# Altium project BC-MPR.PrjPcb (part 2 of 2)

## Sheet MCU Power Clock Debug.SchDoc
size A4; Engineer: Farris Matar; Organization: TESLA Motors, INC; Address1: 3500 Deer Creek Road; Address2: Palo Alto, CA; Address4: U.S.A.; SheetNumber: 10; SheetTotal: 14
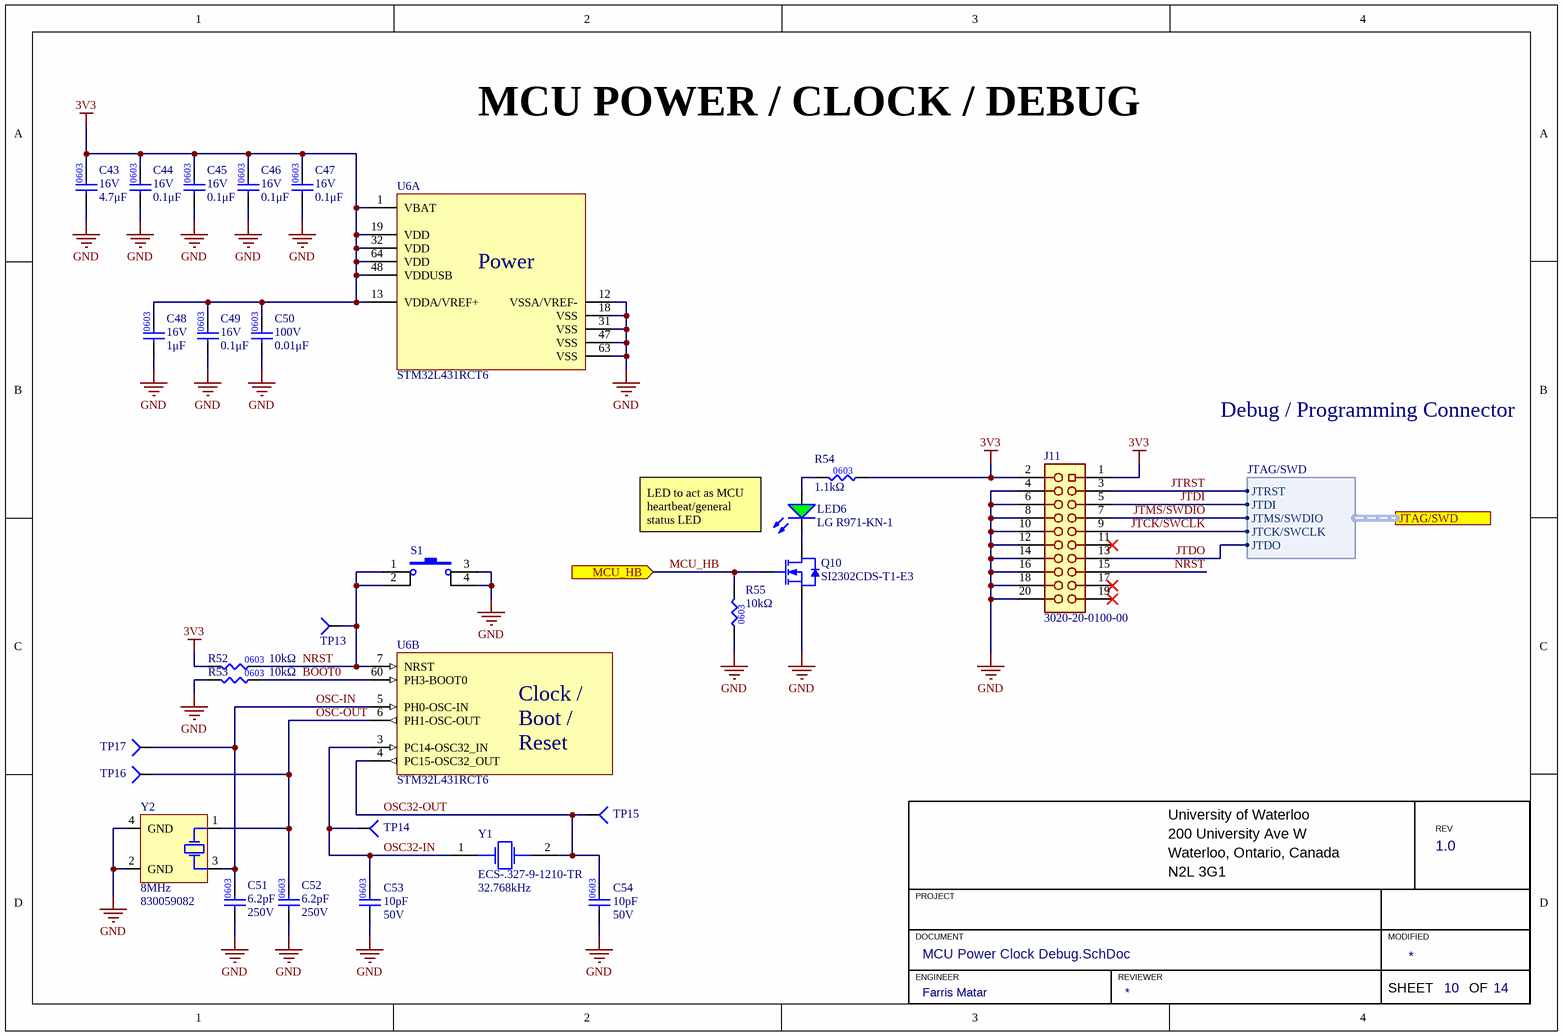
[diagram p8: MCU Power Clock Debug.SchDoc]

### Parts
C43  value 4.7μF  Voltage Rating: 16V  [CAP0603]  (hidden comment: CAP_4.7uF_16V_0603)
C44  value 0.1μF  Voltage Rating: 16V  [CAP0603]  (hidden comment: CAP_0.1uF_16V_0603)
C45  value 0.1μF  Voltage Rating: 16V  [CAP0603]  (hidden comment: CAP_0.1uF_16V_0603)
C46  value 0.1μF  Voltage Rating: 16V  [CAP0603]  (hidden comment: CAP_0.1uF_16V_0603)
C47  value 0.1μF  Voltage Rating: 16V  [CAP0603]  (hidden comment: CAP_0.1uF_16V_0603)
C48  value 1μF  Voltage Rating: 16V  [CAP0603]  (hidden comment: CAP_1uF_16V_0603)
C49  value 0.1μF  Voltage Rating: 16V  [CAP0603]  (hidden comment: CAP_0.1uF_16V_0603)
C50  value 0.01μF  Voltage Rating: 100V  [CAP0603]  (hidden comment: CAP_0.01uF_100V_0603)
C51  value 6.2pF  Voltage Rating: 250V  [CAP0603]  (hidden comment: CAP_6.2pF_250V_0603)
C52  value 6.2pF  Voltage Rating: 250V  [CAP0603]  (hidden comment: CAP_6.2pF_250V_0603)
C53  value 10pF  Voltage Rating: 50V  [CAP0603]  (hidden comment: CAP_10pF_50V_0603)
C54  value 10pF  Voltage Rating: 50V  [CAP0603]  (hidden comment: CAP_10pF_50V_0603)
J11  3020-20-0100-00  [CNC_3020-20-0100-00]
LED6  Manufacturer Part Number 1: LG R971-KN-1  [LED_0805_GREEN]  (hidden comment: LED_GREEN)
Q10  Manufacturer Part Number 1: SI2302CDS-T1-E3  [SOT23-3]  (hidden comment: NMOS_20V_6A)
R52  value 10kΩ  [RES0603]  (hidden comment: RES_10kΩ_0603_1%)
R53  value 10kΩ  [RES0603]  (hidden comment: RES_10kΩ_0603_1%)
R54  value 1.1kΩ  [RES0603]  (hidden comment: RES_1.1kΩ_0603_1%)
R55  value 10kΩ  [RES0603]  (hidden comment: RES_10kΩ_0603_1%)
S1  SW_SPST_NO_4.5x4.5  [SPST_PUSHBUTTON_TL3305AF260QG]  (value not drawn)
TP13  TESTPOINT_1MM_CIRCLE  [TESTPOINT_CIRCLE_1MM]  (value not drawn)  (no BOM)
TP14  TESTPOINT_1MM_CIRCLE  [TESTPOINT_CIRCLE_1MM]  (value not drawn)  (no BOM)
TP15  TESTPOINT_1MM_CIRCLE  [TESTPOINT_CIRCLE_1MM]  (value not drawn)  (no BOM)
TP16  TESTPOINT_1MM_CIRCLE  [TESTPOINT_CIRCLE_1MM]  (value not drawn)  (no BOM)
TP17  TESTPOINT_1MM_CIRCLE  [TESTPOINT_CIRCLE_1MM]  (value not drawn)  (no BOM)
U6  STM32L431RCT6  [STM_LQFP64]  (parts A,B of 5)
Y1  Frequency: 32.768kHz  Manufacturer Part Number 1: ECS-.327-9-1210-TR  [OSC_ECS-327TR-2]  (hidden comment: CRYSTAL_32.768KHZ)
Y2  Frequency: 8MHz  Manufacturer Part Number 1: 830059082  [XTAL_WURTH_830059082]  (hidden comment: CRYSTAL_25MHZ)

### Ports
JTAG/SWD (harness JTAG/SWD), MCU_HB (in)

### Harnesses
JTAG/SWD: JTRST, JTDI, JTMS/SWDIO, JTCK/SWCLK, JTDO

### Nets
3V3: C43.2 C44.2 C45.2 C46.2 C47.2 C48.2 C49.2 C50.2 J11.1 J11.2 R52.1 R54.1 U6.1(VBAT) U6.13(VDDA/VREF+) U6.19(VDD) U6.32(VDD) U6.48(VDDUSB) U6.64(VDD)
GND: C43.1 C44.1 C45.1 C46.1 C47.1 C48.1 C49.1 C50.1 C51.1 C52.1 C53.1 C54.1 J11.4 J11.6 J11.8 J11.10 J11.12 J11.14 J11.16 J11.18 J11.20 Q10.2(SOURCE) R53.1 R55.1 S1.3 S1.4 U6.12(VSSA/VREF-) U6.18(VSS) U6.31(VSS) U6.47(VSS) U6.63(VSS) Y2.2(GND) Y2.4(GND)
BOOT0: R53.2 U6.60(PH3-BOOT0)
JTCK/SWCLK: J11.9 ; port JTAG/SWD.JTCK/SWCLK
JTDI: J11.5 ; port JTAG/SWD.JTDI
JTDO: J11.13 ; port JTAG/SWD.JTDO
JTMS/SWDIO: J11.7 ; port JTAG/SWD.JTMS/SWDIO
JTRST: J11.3 ; port JTAG/SWD.JTRST
MCU_HB: Q10.1(GATE) R55.2 ; port MCU_HB
NRST: J11.15 R52.2 S1.1 S1.2 TP13.1(=value) U6.7(NRST)
OSC32-IN: C53.2 TP14.1(=value) U6.3(PC14-OSC32_IN) Y1.1
OSC32-OUT: C54.2 TP15.1(=value) U6.4(PC15-OSC32_OUT) Y1.2
OSC-IN: C51.2 TP17.1(=value) U6.5(PH0-OSC-IN) Y2.3(HOT)
OSC-OUT: C52.2 TP16.1(=value) U6.6(PH1-OSC-OUT) Y2.1(HOT)
NetLED6_1: LED6.1(A) R54.2
NetLED6_2: LED6.2(K) Q10.3(DRAIN)

Not connected (* = marked no-connect by the designer): J11 11* 17* 19*

### Notes on the sheet
- MCU POWER / CLOCK / DEBUG
- Debug / Programming Connector
- LED to act as MCU heartbeat/general status LED
- University of Waterloo
- 200 University Ave W
- REV
- PROJECT
- Waterloo, Ontario, Canada
- N2L 3G1
- DOCUMENT
- ENGINEER
- REVIEWER
- MODIFIED
- SHEET
- OF
- (in symbol CAP_0.01uF_100V_0603) 0603
- (in symbol STM32L431RCT6, part A) Power
- (in symbol STM32L431RCT6, part B) Clock / / Boot / / Reset

### Library data of the parts
C43 = CAP_4.7uF_16V_0603: CAP CER 4.7UF 16V X6S 0603; Manufacturer Part Number 1: GRM188C81C475KE11D; Manufacturer 1: Murata Electronics; Supplier Part Number 1: 490-13362-1-ND; Supplier 1: Digi-Key; Mounting Type: SMD; Package: 0603; Dielectric: X6S
C44-C47 C49 = CAP_0.1uF_16V_0603: CAP CER 0.1UF 16V X7R 0603; Manufacturer Part Number 1: CC0603KRX7R7BB104; Manufacturer 1: Yageo; Package: 0603; Supplier Part Number 1: 311-1088-1-ND; Supplier 1: Digi-Key; Dielectric: X7R
C48 = CAP_1uF_16V_0603: CAP CER 1UF 16V X7R 0603; Manufacturer 1: Yageo; Manufacturer Part Number 1: CC0603KPX7R7BB105; Supplier Part Number 1: 13-CC0603KPX7R7BB105CT-ND; Supplier 1: Digi-Key; Mounting Type: SMD; Package: 0603; Dielectric: X7R
C50 = CAP_0.01uF_100V_0603: CAP CER 0.01uF 100V X7R 0603; Manufacturer Part Number 1: GCM188R72A103KA37J; Manufacturer 1: Murata Electronics; Supplier Part Number 1: 490-8028-1-ND; Supplier 1: Digi-Key; Dielectric: X7R
C51 C52 = CAP_6.2pF_250V_0603: HVCAP0603 COG 6.2PF .25PF 250V; Manufacturer Part Number 1: CHV0603N2506R2CCT; Manufacturer 1: Cal-Chip Electronics, Inc.; Dielectric: C0G, NP0; Supplier Part Number 1: 4713-CHV0603N2506R2CCT-ND; Supplier 1: Digi-Key; Mounting Type: SMD; Package: 0603
C53 C54 = CAP_10pF_50V_0603: CAP CER 10PF 50V X7R 0603; Manufacturer 1: KEMET; Manufacturer Part Number 1: C0603C100J5RAC7867; Package: 0603; Supplier 1: Digi-Key; Supplier Part Number 1: 399-C0603C100J5RAC7867CT-ND
J11 = CON_10x2_HEADER: CONN HEADER VERT 20POS 2.54MM; Manufacturer 1: CNC Tech; Manufacturer Part Number 1: 3020-20-0100-00; Supplier 1: Digi-Key; Supplier Part Number 1: 1175-1612-ND
LED6 = LED_GREEN: LED GREEN DIFFUSED 0805 SMD; Manufacturer 1: OSRAM; Forward Voltage Drop: 2.2V; Package/Footprint: 0805; Supplier Part Number 1: 475-1410-1-ND; Supplier 1: Digi-Key; Mounting Type: SMD
Q10 = NMOS_20V_2.6A: MOSFET N-CH 20V 2.6A SOT23-3; Manufacturer 1: Vishay Siliconix; Package/Footprint: SOT-23-3; Supplier 1: Digi-Key; Supplier Part Number 1: SI2302CDS-T1-E3CT-ND
R52 R53 R55 = RES_10kΩ_0603_1%: as R5 on sheet Ideal Diode; Supplier Part Number 1: RNCP0603FTD10K0CT-ND; Supplier 1: Digi-Key; Mounting Type: SMD; Package: 0603
R54 = RES_1.1kΩ_0603_1%: RES 1.1K OHM 1% 1/10W 0603; Manufacturer 1: Yageo; Manufacturer Part Number 1: RC0603FR-071K1L; Supplier Part Number 1: 311-1.10KHRCT-ND; Supplier 1: Digi-Key; Mounting Type: SMD; Package: 0603
S1 = SW_SPST_NO_4.5x4.5: SWITCH TACTILE SPST-NO 50MA 12V; Manufacturer Part Number 1: TL3305AF260QG; Manufacturer 1: E-Switch; Mounting Type: SMD; Supplier 1: Digi-Key; Supplier Part Number 1: EG5353CT-ND
TP13-TP17 = TESTPOINT_1MM_CIRCLE: TESTPOINT 1MM CIRCLE
U6 = STM32L431RCT6: IC MCU 32BIT 256KB FLASH 64LQFP; Manufacturer 1: STMicroelectronics; Package/Footprint: 64-LQFP; Manufacturer Part Number 1: STM32L431RCT6; Supplier 1: Digi-Key; Supplier Part Number 1: 497-17960-ND
Y1 = CRYSTAL_32.768KHZ: CRYSTAL 32.7680KHZ 9PF SMD; Manufacturer 1: ECS Inc.; Supplier 1: Digi-Key; Supplier Part Number 1: XC2283CT-ND
Y2 = CRYSTAL_8MHZ_8PF: WE-XTAL QUARTZ CRYSTAL 8.0 MHZ;; Manufacturer 1: Kyocera AVX; Package/Footprint: SMD; Load Capacitance: 10pF; Mounting Type: SMD; Supplier 1: Digikey; Supplier Part Number 1: 1923-830059082CT-ND

## Sheet Control Interface Board.SchDoc
size A4; Engineer: Farris Matar; Organization: TESLA Motors, INC; Address1: 3500 Deer Creek Road; Address2: Palo Alto, CA; Address4: U.S.A.; SheetNumber: 11; SheetTotal: 13
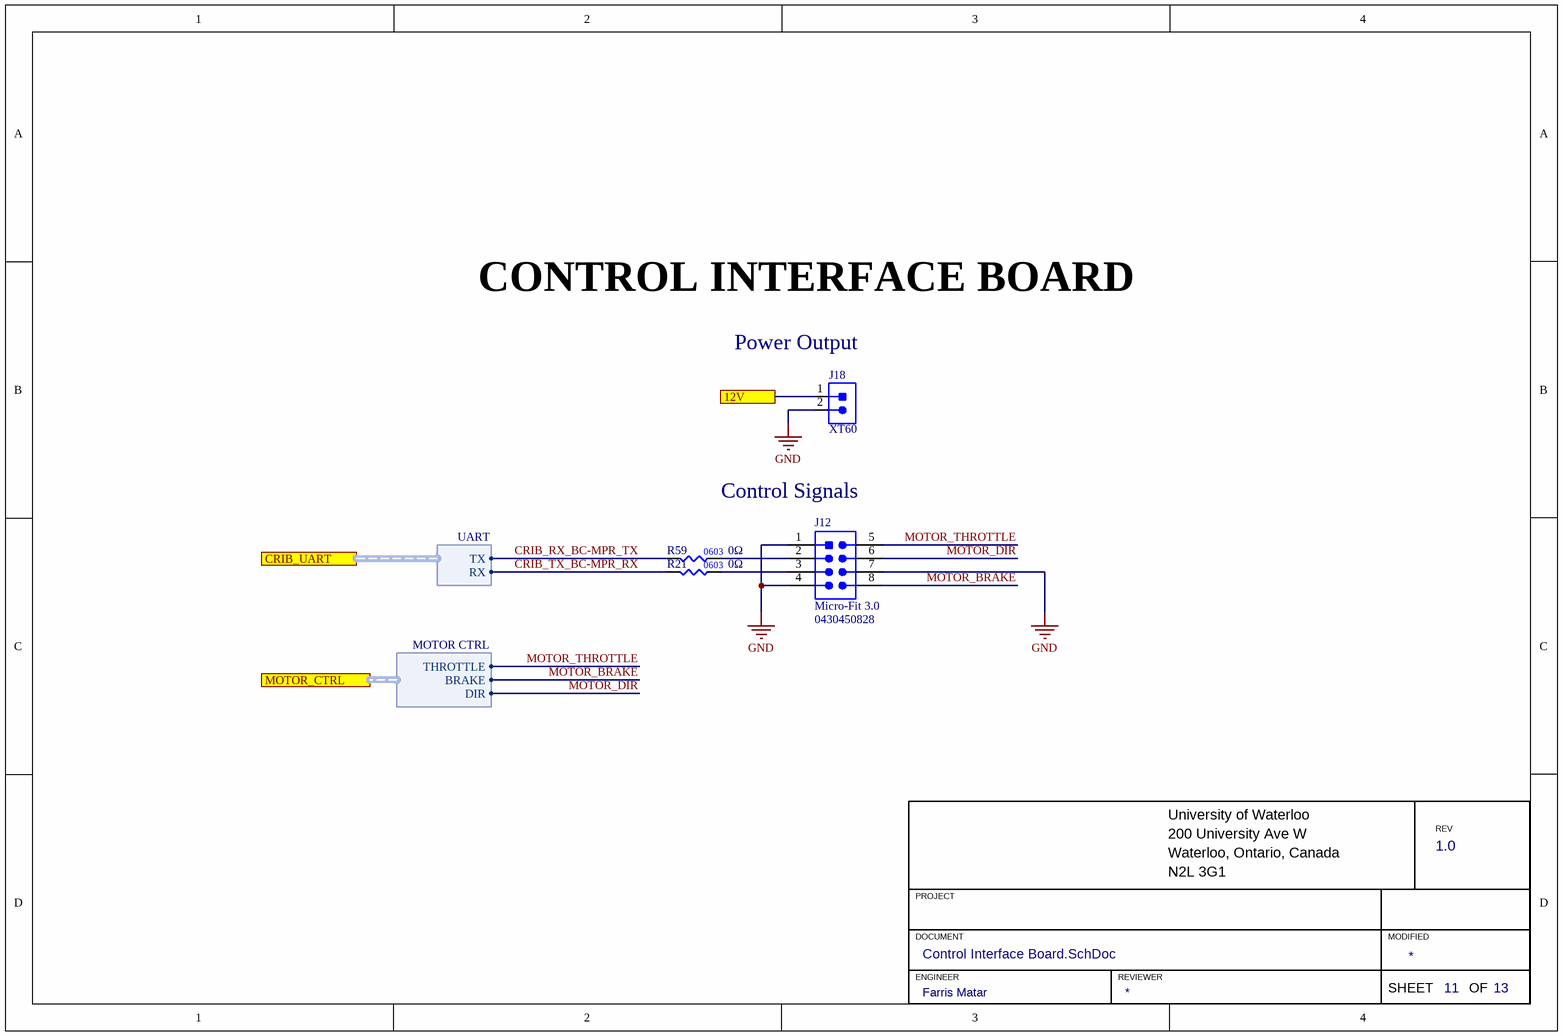
[diagram p9: Control Interface Board.SchDoc]

### Parts
J12  Family: Micro-Fit 3.0  [MOLEX-0430450828]  (hidden comment: 0430450828)
J18  CON_2POS_XT60  [XT60]  (value not drawn)
R21  value 0Ω  [RES0603]  (hidden comment: RES_0Ω_0603)
R59  value 0Ω  [RES0603]  (hidden comment: RES_0Ω_0603)

### Ports
12V, CRIB_UART (harness UART), MOTOR_CTRL (harness MOTOR CTRL)

### Harnesses
UART: TX, RX
MOTOR CTRL: THROTTLE, BRAKE, DIR

### Nets
12V: J18.1 ; port 12V
GND: J12.1 J12.4 J12.7 J18.2
CRIB_RX_BC-MPR_TX: R59.1 ; port CRIB_UART.TX
CRIB_TX_BC-MPR_RX: R21.1 ; port CRIB_UART.RX
MOTOR_BRAKE: J12.8 ; port MOTOR_CTRL.BRAKE
MOTOR_DIR: J12.6 ; port MOTOR_CTRL.DIR  [project net MOTOR_CTRL.DIR]
MOTOR_THROTTLE: J12.5 ; port MOTOR_CTRL.THROTTLE  [project net MOTOR_CTRL.THROTTLE]
NetJ12_2: J12.2 R59.2
NetJ12_3: J12.3 R21.2

### Notes on the sheet
- CONTROL INTERFACE BOARD
- (near J18) Power Output
- Control Signals
- University of Waterloo
- 200 University Ave W
- REV
- PROJECT
- Waterloo, Ontario, Canada
- N2L 3G1
- DOCUMENT
- ENGINEER
- REVIEWER
- MODIFIED
- SHEET
- OF

### Library data of the parts
J12 = CON_MOLEX-HDR_4x2_TH: CONN HEADER VERT 8POS 3MM; Manufacturer 1: Molex; Voltage Rating: 250VAC; Current Rating: 5A; Pitch: 3mm; Supplier 1: Digi-Key; Supplier Part Number 1: WM10693-ND; Manufacturer Part Number 1: 0430450828
J18 = CON_2POS_XT60: XT60 CONNECTORS MALE/FEMALE PAIR; Manufacturer 1: SparkFun Electronics; Manufacturer Part Number 1: PRT-10474; Mounting Type: TH; Package/Footprint: XT60; Supplier 1: Digi-Key; Supplier Part Number 1: 1568-1816-ND
R21 R59 = RES_0Ω_0603: RES 0 OHM JUMPER 1/10W 0603; Manufacturer 1: Yageo; Manufacturer Part Number 1: RC0603JR-070RL; Supplier Part Number 1: 311-0.0GRCT-ND; Supplier 1: Digi-Key; Mounting Type: SMD; Package: 0603

## Sheet External Supply Interface.SchDoc
size A4; Engineer: Farris Matar; Organization: TESLA Motors, INC; Address1: 3500 Deer Creek Road; Address2: Palo Alto, CA; Address4: U.S.A.; SheetNumber: 12; SheetTotal: 13
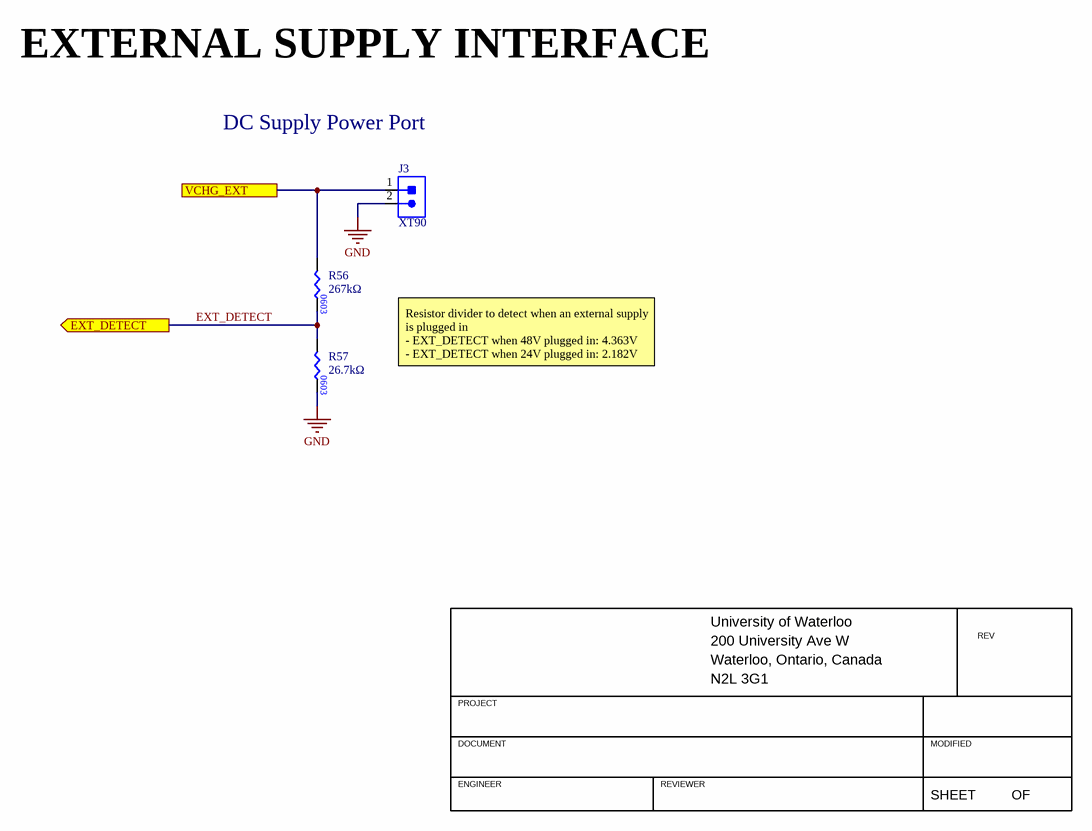
[diagram p10: External Supply Interface.SchDoc]

### Parts
J3  CON_2POS_XT90  [XT90]  (value not drawn)
R56  value 267kΩ  [RES0603]  (hidden comment: RES_267kΩ_0603_1%)
R57  value 26.7kΩ  [RES0603]  (hidden comment: RES_26.7kΩ_0603_1%)

### Ports
EXT_DETECT (out), VCHG_EXT

### Nets
GND: J3.2 R57.2
VCHG_EXT: J3.1 R56.1 ; port VCHG_EXT
EXT_DETECT: R56.2 R57.1 ; port EXT_DETECT

### Notes on the sheet
- EXTERNAL SUPPLY INTERFACE
- DC Supply Power Port
- Resistor divider to detect when an external supply is plugged in
  - EXT_DETECT when 48V plugged in: 4.363V
  - EXT_DETECT when 24V plugged in: 2.182V
- University of Waterloo
- 200 University Ave W
- REV
- PROJECT
- Waterloo, Ontario, Canada
- N2L 3G1
- DOCUMENT
- ENGINEER
- REVIEWER
- MODIFIED
- SHEET
- OF
- (in symbol RES_26.7kΩ_0603_1%) 0603

### Library data of the parts
J3 = CON_2POS_XT90: HIGH QUALITY GOLD PLATED XT90 MA; Manufacturer 1: DFRobot; Manufacturer Part Number 1: FIT0588; Mounting Type: TH; Package/Footprint: XT90; Supplier 1: Digi-Key; Supplier Part Number 1: 1738-1438-ND
R56 = RES_267kΩ_0603_1%: RES 267K OHM 1% 1/10W 0603; Manufacturer 1: Panasonic Electronic Components; Manufacturer Part Number 1: ERJ-3EKF2673V; Supplier 1: Digi-Key; Supplier Part Number 1: P267KHCT-ND; Package: 0603
R57 = RES_26.7kΩ_0603_1%: RES 26.7K OHM 1% 1/10W 0603; Manufacturer 1: Yageo; Manufacturer Part Number 1: RC0603FR-0726K7L; Supplier Part Number 1: 311-26.7KHRCT-ND; Supplier 1: Digi-Key

## Sheet Fan Power Switch.SchDoc
size A4; Engineer: Farris Matar; Organization: TESLA Motors, INC; Address1: 3500 Deer Creek Road; Address2: Palo Alto, CA; Address4: U.S.A.; SheetNumber: 13; SheetTotal: 14
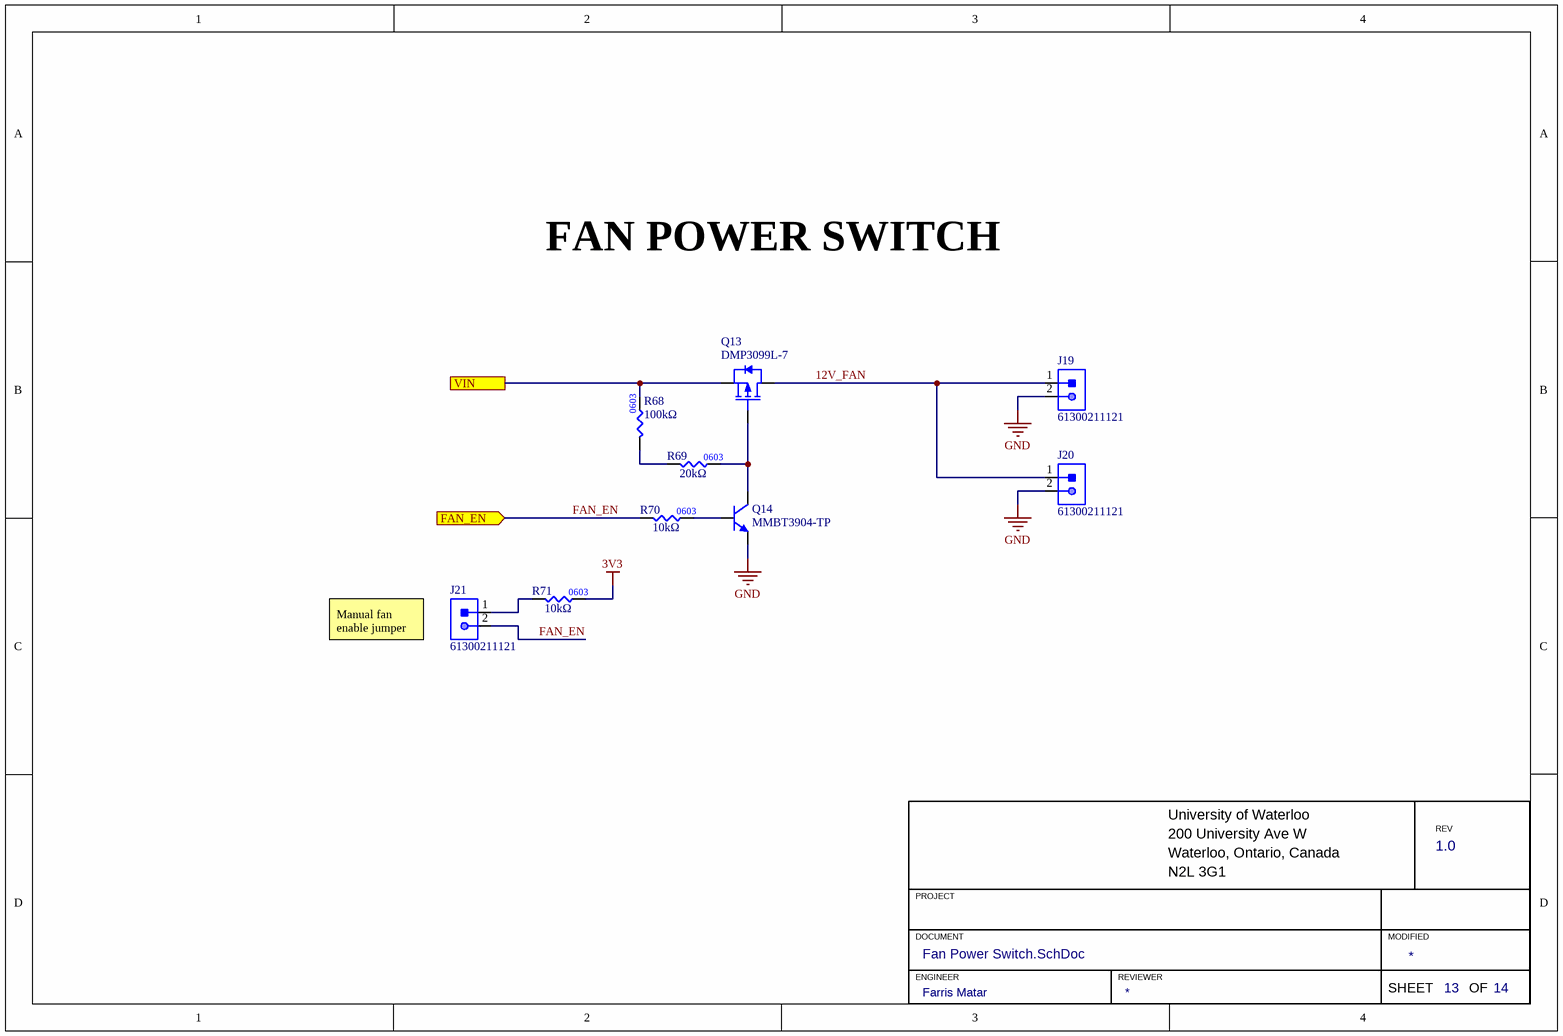
[diagram p11: Fan Power Switch.SchDoc]

### Parts
J19  Manufacturer Part Number 1: 61300211121  [HDR1X2]  (hidden comment: HEADER 2x1)
J20  Manufacturer Part Number 1: 61300211121  [HDR1X2]  (hidden comment: HEADER 2x1)
J21  Manufacturer Part Number 1: 61300211121  [HDR1X2]  (hidden comment: HEADER 2x1)
Q13  Manufacturer Part Number 1: DMP3099L-7  [DIO-INC_SOT23]  (hidden comment: PMOS_30V_3.8A)
Q14  Manufacturer Part Number 1: MMBT3904-TP  [SOT23-3]  (hidden comment: NPN_40V_100mA)
R68  value 100kΩ  [RES0603]  (hidden comment: RES_100kΩ_0603_1%)
R69  value 20kΩ  [RES0603]  (hidden comment: RES_20kΩ_0603_1%)
R70  value 10kΩ  [RES0603]  (hidden comment: RES_10kΩ_0603_1%)
R71  value 10kΩ  [RES0603]  (hidden comment: RES_10kΩ_0603_1%)

### Ports
FAN_EN (in), VIN

### Nets
3V3: R71.2
GND: J19.2 J20.2 Q14.2(E)
12V_FAN: J19.1(VCC) J20.1(VCC) Q13.3(Drain)
FAN_EN: J21.2 R70.1 ; port FAN_EN
NetJ21_1: J21.1(VCC) R71.1
NetQ13_1: Q13.1(Gate) Q14.3(C) R69.2
NetQ13_2: Q13.2(Source) R68.2 ; port VIN
NetQ14_1: Q14.1(B) R70.2
NetR68_1: R68.1 R69.1

### Notes on the sheet
- FAN POWER SWITCH
- Manual fan enable jumper
- University of Waterloo
- 200 University Ave W
- REV
- PROJECT
- Waterloo, Ontario, Canada
- N2L 3G1
- DOCUMENT
- ENGINEER
- REVIEWER
- MODIFIED
- SHEET
- OF
- (in symbol RES_20kΩ_0603_1%) 0603
- (in symbol RES_100kΩ_0603_1%) 0603

### Library data of the parts
J19-J21 = HEADER 2x1: Manufacturer 1: Würth Elektronik; Package/Footprint: TH; Mounting Type: TH; Supplier 1: Digi-Key; Supplier Part Number 1: 732-5315-ND
Q13 = PMOS_30V_3.8A: MOSFET P-CH 30V 3.8A SOT23; Manufacturer 1: Diodes Incorporated; Supplier 1: Digi-Key; Supplier Part Number 1: DMP3099L-7DICT-ND
Q14 = NPN_40V_100mA: TRANS NPN 40V 0.2A SOT23; Manufacturer 1: Micro Commercial Co; Package: SOT-23-3; Supplier Part Number 1: MMBT3904TPMSCT-ND; Supplier 1: Digi-Key
R68 = RES_100kΩ_0603_1%: RES 100K OHM 1% 1/10W 0603; Manufacturer 1: Yageo; Manufacturer Part Number 1: RC0603FR-07100KL; Supplier Part Number 1: 311-100KHRCT-ND; Supplier 1: Digi-Key
R69 = RES_20kΩ_0603_1%: RES 20K OHM 1% 1/10W 0603; Manufacturer 1: Yageo; Manufacturer Part Number 1: RC0603FR-0720KL; Supplier Part Number 1: 311-20.0KHRCT-ND; Supplier 1: Digi-Key
R70 R71 = RES_10kΩ_0603_1%: RES 10K OHM 1% 1/8W 0603; Manufacturer 1: Stackpole Electronics Inc; Manufacturer Part Number 1: RNCP0603FTD10K0; Supplier Part Number 1: RNCP0603FTD10K0CT-ND; Supplier 1: Digi-Key; Mounting Type: SMD; Package: 0603

## Nets that join several sheets
3V3: LV Power (5 pins), BQ25756 Data Config (R44.2 R48.2 R50.2 R51.2), MCU Power Clock Debug (18 pins), Fan Power Switch (R71.2)
12V: Motor Controller Interface (J5.1), LV Power (13 pins), HV Power Stage (R20.1), Control Interface Board (J18.1)
GND: CHG Ideal Diode (6 pins), DSG Ideal Diode (6 pins), EXT Supply Ideal Diode (6 pins), Motor Controller Interface (8 pins), Motor Power Switch (9 pins), LV Power (20 pins), HV Power Stage (35 pins), BQ25756 Data Config (9 pins), STM32 MCU (Q12.2), MCU Power Clock Debug (33 pins), Control Interface Board (J12.1 J12.4 J12.7 J18.2), External Supply Interface (J3.2 R57.2), Fan Power Switch (J19.2 J20.2 Q14.2)
MOTOR_36V: Motor Controller Interface (J4.1), Motor Power Switch (C6.2 C7.2 D5.1 Q4.5)
VAC: EXT Supply Ideal Diode (C3C.2 Q1C.5 TP2C.1 U1C.7), Motor Power Switch (5 pins), HV Power Stage (8 pins), BQ25756 Data Config (R35.2)
VCHG_EXT: EXT Supply Ideal Diode (9 pins), External Supply Interface (J3.1 R56.1)
VSYS: CHG Ideal Diode (9 pins), DSG Ideal Diode (C3B.2 Q1B.5 TP2B.1 U1B.7), LV Power (5 pins), HV Power Stage (5 pins), BQ25756 Data Config (J10.2 R49.2)
5V0_REGN: HV Power Stage (C35.2 U5.24), BQ25756 Data Config (5 pins)
CE_n: BQ25756 Data Config (R48.1 TP6.1 U5.7), STM32 MCU (U6.38)
CHG_DIS: CHG Ideal Diode (Q2A.1 R5A.2), STM32 MCU (U6.36)
CRIB_RX_BC-MPR_TX: STM32 MCU (U6.16), Control Interface Board (R59.1)
CRIB_TX_BC-MPR_RX: STM32 MCU (U6.17), Control Interface Board (R21.1)
CS_A: Motor Controller Interface (J7.3), STM32 MCU (U6.8)
DSG_DIS: DSG Ideal Diode (Q2B.1 R5B.2), STM32 MCU (U6.35)
EXT_DETECT: Motor Power Switch (Q11.1), STM32 MCU (Q12.1), External Supply Interface (R56.2 R57.1)
EXT_DIS: EXT Supply Ideal Diode (Q2C.1 R5C.2), STM32 MCU (U6.34)
HALL_A: Motor Controller Interface (J7.6), STM32 MCU (U6.9)
HALL_B: Motor Controller Interface (J7.4), STM32 MCU (U6.10)
HALL_C: Motor Controller Interface (J7.1), STM32 MCU (U6.11)
I2C.SCL: BQ25756 Data Config (R51.1 U5.1), STM32 MCU (U6.61)
I2C.SDA: BQ25756 Data Config (R50.1 U5.2), STM32 MCU (U6.62)
INT_n: BQ25756 Data Config (R44.1 TP7.1 U5.3), STM32 MCU (U6.37)
JTCK/SWCLK: STM32 MCU (U6.49), MCU Power Clock Debug (J11.9)
JTDI: STM32 MCU (U6.50), MCU Power Clock Debug (J11.5)
JTDO: STM32 MCU (U6.55), MCU Power Clock Debug (J11.13)
JTMS/SWDIO: STM32 MCU (U6.46), MCU Power Clock Debug (J11.7)
JTRST: STM32 MCU (U6.56), MCU Power Clock Debug (J11.3)
MCU_HB: STM32 MCU (U6.39), MCU Power Clock Debug (Q10.1 R55.2)
MOTOR_BRAKE: STM32 MCU (U6.21), Control Interface Board (J12.8)
MOTOR_CTRL.DIR: STM32 MCU (U6.22), Control Interface Board (J12.6)
MOTOR_CTRL.THROTTLE: STM32 MCU (U6.20), Control Interface Board (J12.5)
MOTOR_EN: Motor Power Switch (R58.1), STM32 MCU (U6.33)
PHASE_A_H_PWM: Motor Controller Interface (J6.10), STM32 MCU (U6.41)
PHASE_A_L_PWM: Motor Controller Interface (J6.3), STM32 MCU (U6.23)
PHASE_B_H_PWM: Motor Controller Interface (J6.5), STM32 MCU (U6.42)
PHASE_B_L_PWM: Motor Controller Interface (J6.6), STM32 MCU (U6.26)
PHASE_C_H_PWM: Motor Controller Interface (J6.8), STM32 MCU (U6.43)
PHASE_C_L_PWM: Motor Controller Interface (J6.1), STM32 MCU (U6.27)

## Assembly variants
BUILD: not fitted D1A D1B D1C